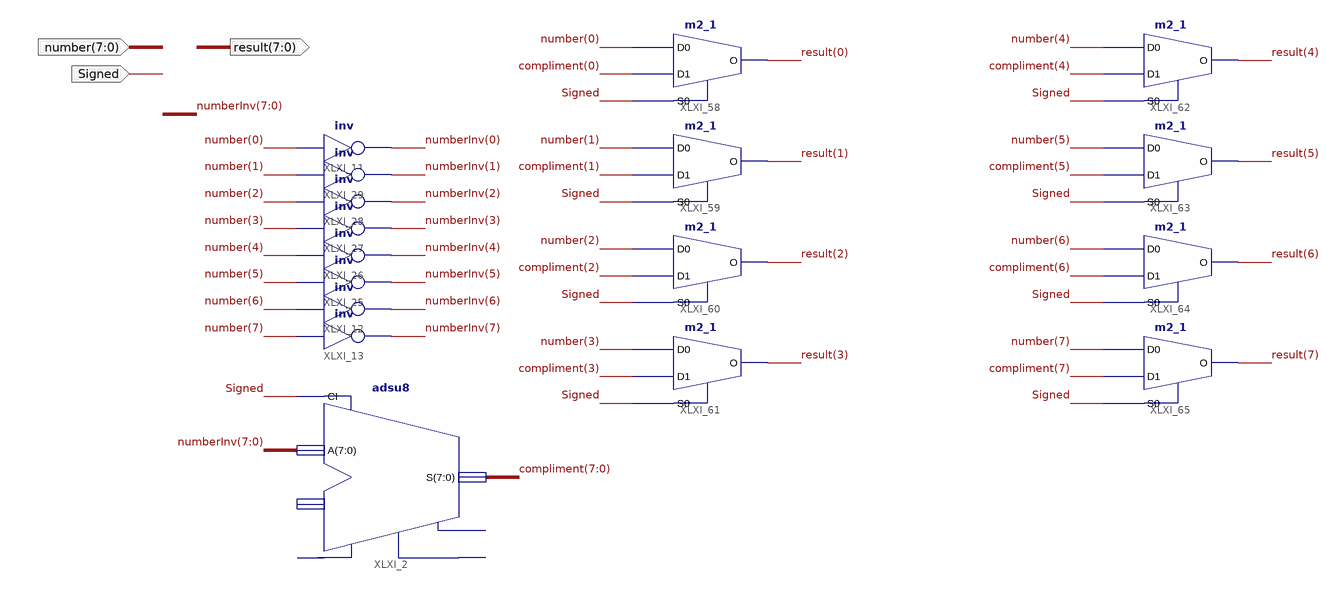
[diagram p0: schematic sheet 1]
// Xilinx ISE schematic signConverter2.sch (spartan3e) as structural Verilog: 17 symbols, 4 ports
module signConverter2 (
  input  [7:0] number,
  input  Signed,
  output [7:0] compliment,
  output [7:0] result
);

  wire [7:0] numberInv;

  not XLXI_11 (numberInv[0], number[0]);
  not XLXI_13 (numberInv[7], number[7]);
  not XLXI_12 (numberInv[6], number[6]);
  not XLXI_25 (numberInv[5], number[5]);
  not XLXI_26 (numberInv[4], number[4]);
  not XLXI_27 (numberInv[3], number[3]);
  not XLXI_28 (numberInv[2], number[2]);
  not XLXI_29 (numberInv[1], number[1]);
  adsu8 XLXI_2 (.A(numberInv), .CI(Signed), .S(compliment));  // open: ADD, B, CO, OFL
  m2_1 XLXI_62 (.D0(number[4]), .D1(compliment[4]), .S0(Signed), .O(result[4]));
  m2_1 XLXI_63 (.D0(number[5]), .D1(compliment[5]), .S0(Signed), .O(result[5]));
  m2_1 XLXI_64 (.D0(number[6]), .D1(compliment[6]), .S0(Signed), .O(result[6]));
  m2_1 XLXI_65 (.D0(number[7]), .D1(compliment[7]), .S0(Signed), .O(result[7]));
  m2_1 XLXI_58 (.D0(number[0]), .D1(compliment[0]), .S0(Signed), .O(result[0]));
  m2_1 XLXI_59 (.D0(number[1]), .D1(compliment[1]), .S0(Signed), .O(result[1]));
  m2_1 XLXI_60 (.D0(number[2]), .D1(compliment[2]), .S0(Signed), .O(result[2]));
  m2_1 XLXI_61 (.D0(number[3]), .D1(compliment[3]), .S0(Signed), .O(result[3]));
endmodule
